# Altium project MT7688.PrjPcb (part 2 of 2)

## Sheet Part15_I2C_LED.SchDoc
size A4
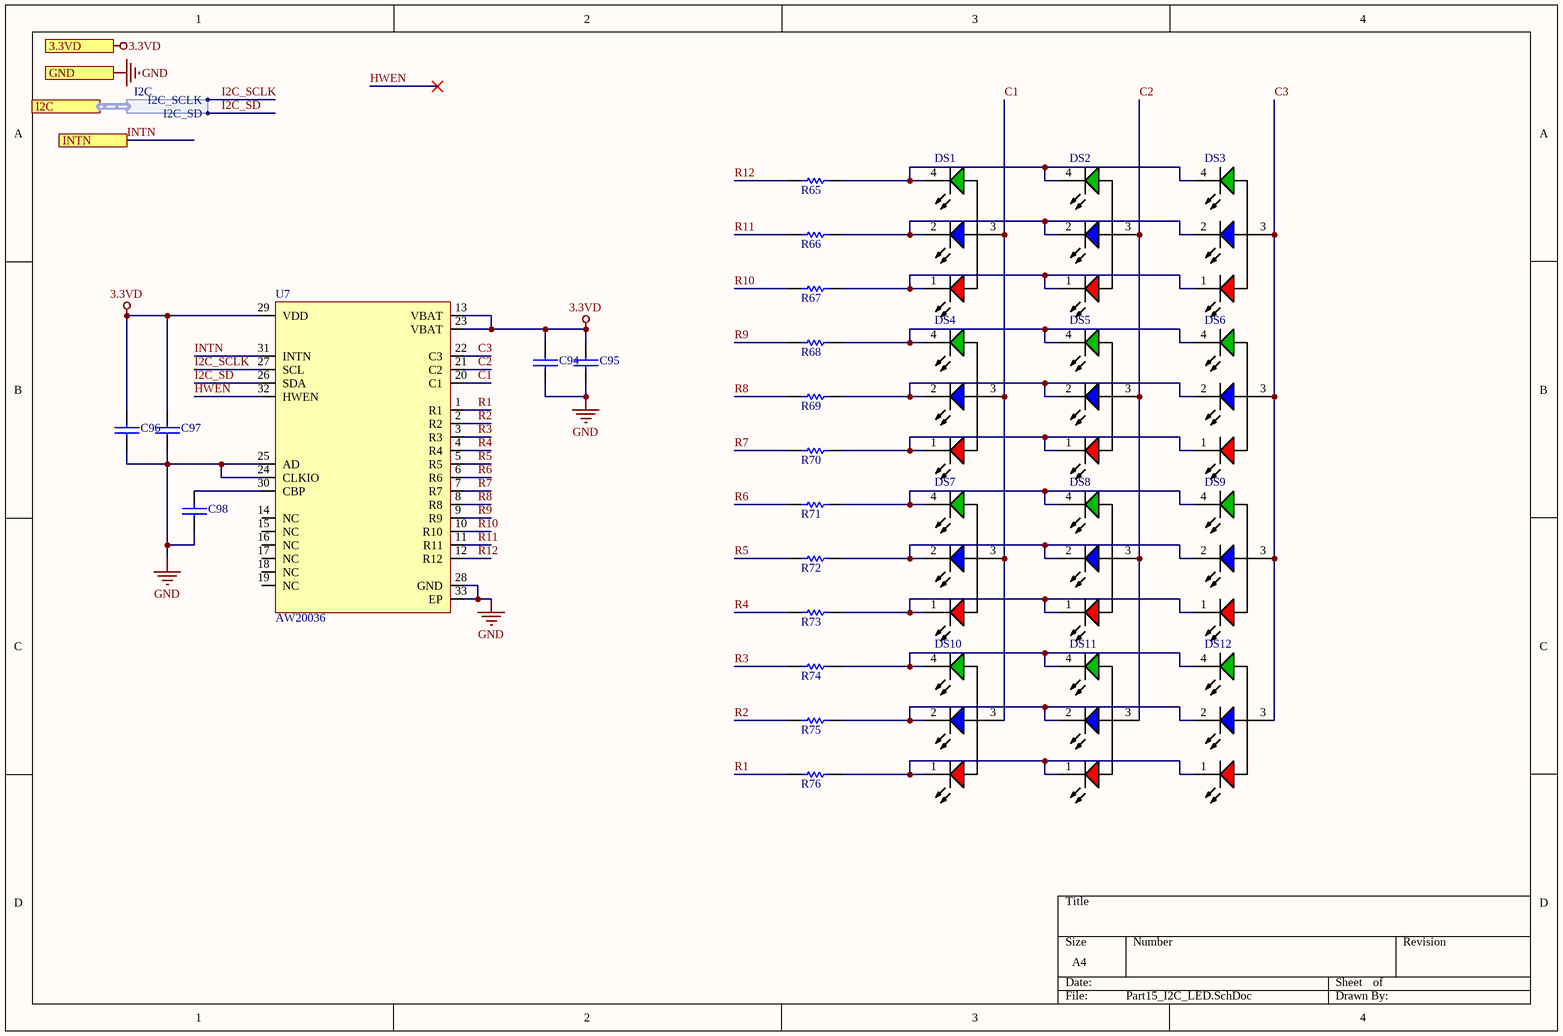
[diagram p21: Part15_I2C_LED.SchDoc]

### Parts
C94  100nF  [0402C]  (value not drawn)
C95  4.7uF  [0402C]  (value not drawn)
C96  1uF  [0402C]  (value not drawn)
C97  100nF  [0402C]  (value not drawn)
C98  1uF  [0402C]  (value not drawn)
DS1  CLVBA-FKA-CAEDH8BBB7A363  [RGB_LED]  (value not drawn)
DS2  CLVBA-FKA-CAEDH8BBB7A363  [RGB_LED]  (value not drawn)
DS3  CLVBA-FKA-CAEDH8BBB7A363  [RGB_LED]  (value not drawn)
DS4  CLVBA-FKA-CAEDH8BBB7A363  [RGB_LED]  (value not drawn)
DS5  CLVBA-FKA-CAEDH8BBB7A363  [RGB_LED]  (value not drawn)
DS6  CLVBA-FKA-CAEDH8BBB7A363  [RGB_LED]  (value not drawn)
DS7  CLVBA-FKA-CAEDH8BBB7A363  [RGB_LED]  (value not drawn)
DS8  CLVBA-FKA-CAEDH8BBB7A363  [RGB_LED]  (value not drawn)
DS9  CLVBA-FKA-CAEDH8BBB7A363  [RGB_LED]  (value not drawn)
DS10  CLVBA-FKA-CAEDH8BBB7A363  [RGB_LED]  (value not drawn)
DS11  CLVBA-FKA-CAEDH8BBB7A363  [RGB_LED]  (value not drawn)
DS12  CLVBA-FKA-CAEDH8BBB7A363  [RGB_LED]  (value not drawn)
R65  51R  [0402R]  (value not drawn)
R66  20R  [0402R]  (value not drawn)
R67  20R  [0402R]  (value not drawn)
R68  51R  [0402R]  (value not drawn)
R69  20R  [0402R]  (value not drawn)
R70  20R  [0402R]  (value not drawn)
R71  51R  [0402R]  (value not drawn)
R72  20R  [0402R]  (value not drawn)
R73  20R  [0402R]  (value not drawn)
R74  51R  [0402R]  (value not drawn)
R75  20R  [0402R]  (value not drawn)
R76  20R  [0402R]  (value not drawn)
U7  AW20036  [QFN40P400X400X80_HS-33N]

### Ports
3.3VD, GND, I2C (harness I2C), INTN

### Harnesses
I2C: I2C_SCLK, I2C_SD

### Nets
3.3VD: C94.1 C95.1 C96.1 C97.1 U7.13(VBAT) U7.23(VBAT) U7.29(VDD) ; port 3.3VD
GND: C94.2 C95.2 C96.2 C97.2 C98.2 U7.24(CLKIO) U7.25(AD) U7.28(GND) U7.33(EP) ; port GND
C1: DS1.3(COMMON) DS4.3(COMMON) DS7.3(COMMON) DS10.3(COMMON) U7.20(C1)
C2: DS2.3(COMMON) DS5.3(COMMON) DS8.3(COMMON) DS11.3(COMMON) U7.21(C2)
C3: DS3.3(COMMON) DS6.3(COMMON) DS9.3(COMMON) DS12.3(COMMON) U7.22(C3)
HWEN: U7.32(HWEN)
I2C_SCLK: U7.27(SCL) ; port I2C.I2C_SCLK
I2C_SD: U7.26(SDA) ; port I2C.I2C_SD
INTN: U7.31(INTN) ; port INTN  [project net EXT_IO_0]
R1: R76.1 U7.1(R1)
R2: R75.1 U7.2(R2)
R3: R74.1 U7.3(R3)
R4: R73.1 U7.4(R4)
R5: R72.1 U7.5(R5)
R6: R71.1 U7.6(R6)
R7: R70.1 U7.7(R7)
R8: R69.1 U7.8(R8)
R9: R68.1 U7.9(R9)
R10: R67.1 U7.10(R10)
R11: R66.1 U7.11(R11)
R12: R65.1 U7.12(R12)
NetC98_1: C98.1 U7.30(CBP)
NetDS1_1: DS1.1(RED) DS2.1(RED) DS3.1(RED) R67.2
NetDS1_2: DS1.2(BLUE) DS2.2(BLUE) DS3.2(BLUE) R66.2
NetDS1_4: DS1.4(GREEN) DS2.4(GREEN) DS3.4(GREEN) R65.2
NetDS4_1: DS4.1(RED) DS5.1(RED) DS6.1(RED) R70.2
NetDS4_2: DS4.2(BLUE) DS5.2(BLUE) DS6.2(BLUE) R69.2
NetDS4_4: DS4.4(GREEN) DS5.4(GREEN) DS6.4(GREEN) R68.2
NetDS7_1: DS7.1(RED) DS8.1(RED) DS9.1(RED) R73.2
NetDS7_2: DS7.2(BLUE) DS8.2(BLUE) DS9.2(BLUE) R72.2
NetDS7_4: DS7.4(GREEN) DS8.4(GREEN) DS9.4(GREEN) R71.2
NetDS10_1: DS10.1(RED) DS11.1(RED) DS12.1(RED) R76.2
NetDS10_2: DS10.2(BLUE) DS11.2(BLUE) DS12.2(BLUE) R75.2
NetDS10_4: DS10.4(GREEN) DS11.4(GREEN) DS12.4(GREEN) R74.2

Not connected (* = marked no-connect by the designer): U7 14(NC) 15(NC) 16(NC) 17(NC) 18(NC) 19(NC)

### Library data of the parts
C94-C98 = CAP: 无极性电容
DS1-DS12 = LED-RGB-KCKK-4: 3-in-1 SMD Led, 1.9 V Red, 3 V Green, 3 V Blue, -40 to 100 degC, 4-Pin PLCC, RoHS, Reel; Luminous Intensity: 71mcd,140mcd,36mcd; Viewing Angle: 120deg; Brand: Cree,Inc.; Lens Color/Style: UVTinted; Forward Current: 20mA; LED Size: 3.2mmx2.8mmx1.9mm; Wavelength/Color Temperature: 630nm,527nm,470nm; Forward Voltage: 1.9V,3V,3V; Illumination Color: RGB; Package / Case: PLCC-4; Package Reference: PLCC-4; Packaging: Reel; Maximum Operating Temperature: +100C; Minimum Operating Temperature: -40C; Product Category: StandardLEDs-SMD; Manufacturer URL: http://www.cree.com/; RoHS: Details; Factory Pack Quantity: 2000; Datasheet URL: http://datasheet.octopart.com/CLVBA-FKA-CAEDH8BBB7A363-Cree-datasheet-44497822.pdf; Manufacturer: Cree,Inc.; Mounting Technology: SurfaceMount; Package Description: 4-Pin Plastic Leaded Chip Carrier, Body 3.2 x 2.8 mm; Datasheet Version: 12/2014
R65-R76 = RES

## Sheet Part16_I2C_MPU9250.SchDoc
size A4
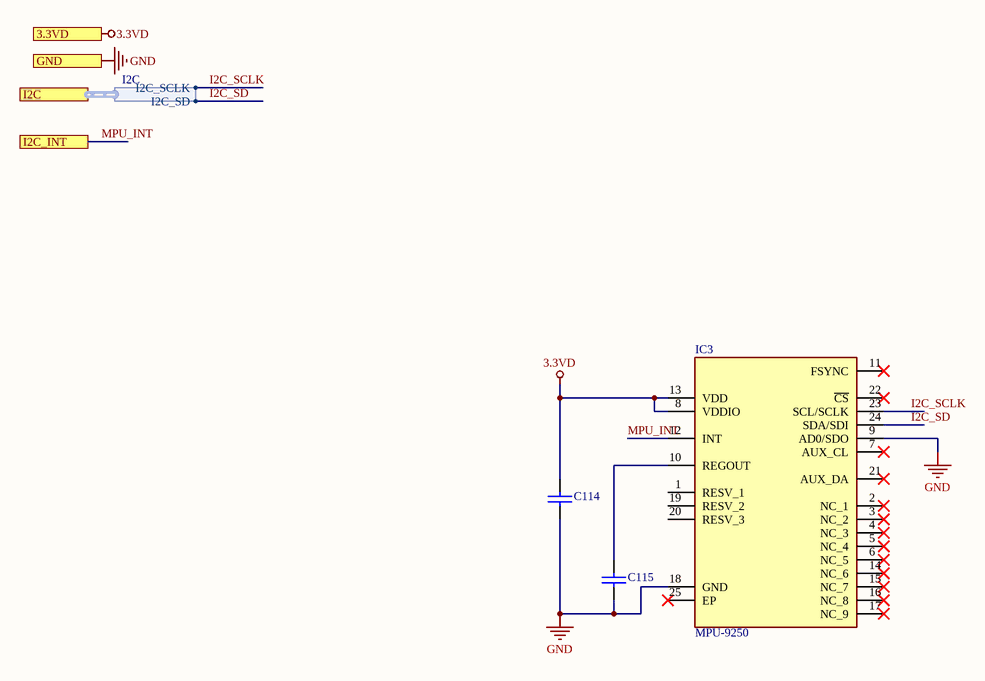
[diagram p22: Part16_I2C_MPU9250.SchDoc]

### Parts
C114  100nF  [0402C]  (value not drawn)
C115  100nF  [0402C]  (value not drawn)
IC3  MPU-9250  [QFN40P300X300X105-25N-D]

### Ports
3.3VD, GND, I2C (harness I2C), I2C_INT

### Harnesses
I2C: I2C_SCLK, I2C_SD

### Nets
3.3VD: C114.1 IC3.8(VDDIO) IC3.13(VDD) ; port 3.3VD
GND: C114.2 C115.2 IC3.9(AD0/SDO) IC3.18(GND) ; port GND
I2C_SCLK: IC3.23(SCL/SCLK) ; port I2C.I2C_SCLK
I2C_SD: IC3.24(SDA/SDI) ; port I2C.I2C_SD
MPU_INT: IC3.12(INT) ; port I2C_INT  [project net EXT_IO_1]
NetC115_1: C115.1 IC3.10(REGOUT)

Not connected (* = marked no-connect by the designer): IC3 1(RESV_1) 2(NC_1)* 3(NC_2)* 4(NC_3)* 5(NC_4)* 6(NC_5)* 7(AUX_CL)* 11(FSYNC)* 14(NC_6)* 15(NC_7)* 16(NC_8)* 17(NC_9)* 19(RESV_2) 20(RESV_3) 21(AUX_DA)* 22(~{CS})* 25(EP)*

### Library data of the parts
C114 C115 = CAP: 无极性电容
IC3 = MPU-9250: Integrated Circuit; Manufacturer_Name: InvenSense Inc.; Datasheet Link: https://store.invensense.com/datasheets/invensense/MPU9250REV1.0.pdf; Height: 1.05mm; Manufacturer_Part_Number: MPU-9250; Arrow Part Number: MPU-9250; Mouser Part Number: 410-MPU-9250; Mouser Price/Stock: https://www.mouser.co.uk/ProductDetail/TDK-InvenSense/MPU-9250?qs=u4fy%2FsgLU9OhGjFkQSZssA%3D%3D

## Sheet Part17_I2C_SHT30.SchDoc
size A4
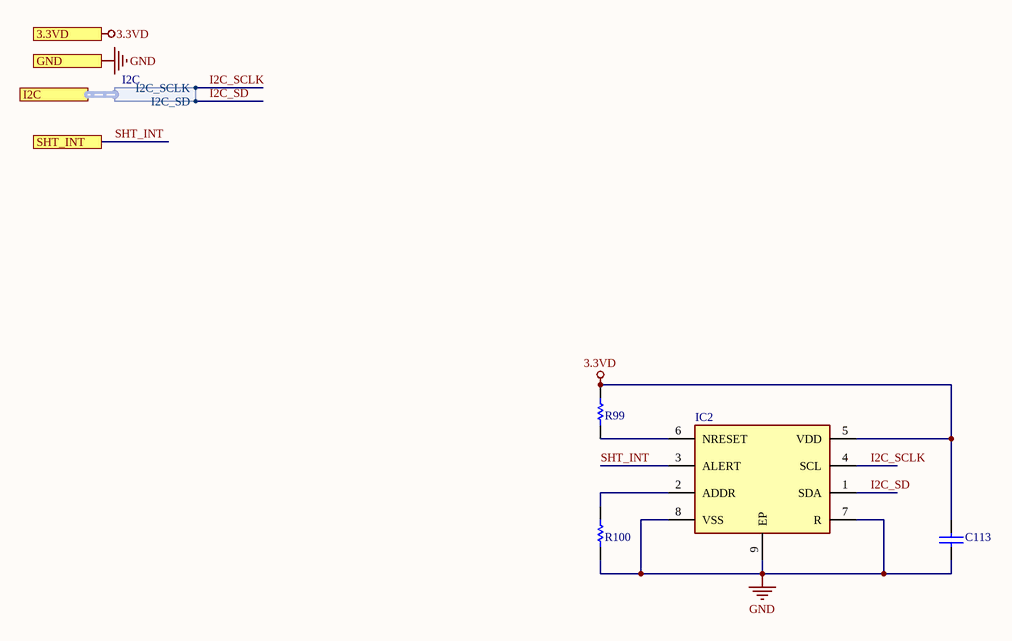
[diagram p23: Part17_I2C_SHT30.SchDoc]

### Parts
C113  100nF  [0402C]  (value not drawn)
IC2  SHT31-DIS-B2.5KS  [SON50P250X250X100-9N-D]  (value not drawn)
R99  10K  [0402R]  (value not drawn)
R100  10K  [0402R]  (value not drawn)

### Ports
3.3VD, GND, I2C (harness I2C), SHT_INT

### Harnesses
I2C: I2C_SCLK, I2C_SD

### Nets
3.3VD: C113.1 IC2.5(VDD) R99.2 ; port 3.3VD
GND: C113.2 IC2.7(R) IC2.8(VSS) IC2.9(EP) R100.1 ; port GND
I2C_SCLK: IC2.4(SCL) ; port I2C.I2C_SCLK
I2C_SD: IC2.1(SDA) ; port I2C.I2C_SD
SHT_INT: IC2.3(ALERT) ; port SHT_INT  [project net EXT_IO_2]
NetIC2_2: IC2.2(ADDR) R100.2
NetIC2_6: IC2.6(NRESET) R99.1

### Library data of the parts
C113 = CAP: 无极性电容
IC2 = SHT31-DIS-B2.5KS: Integrated Circuit; Manufacturer_Name: Sensirion; Datasheet Link: http://www.mouser.com/ds/2/682/Sensirion_Humidity_Sensors_SHT3x_Datasheet_digital-971521.pdf; Height: 1mm; Manufacturer_Part_Number: SHT31-DIS-B2.5KS; Arrow Part Number: SHT31-DIS-B2.5KS; Arrow Price/Stock: https://www.arrow.com/en/products/sht31-dis-b2.5ks/sensirion-ag; Mouser Part Number: 403-SHT31-DIS-B; Mouser Price/Stock: https://www.mouser.co.uk/ProductDetail/Sensirion/SHT31-DIS-B25kS?qs=y6ZabgHbY%252ByCkzTLGvP3Qw%3D%3D
R99 R100 = RES

## Sheet Part19_UART_CP2104.SchDoc
size A4
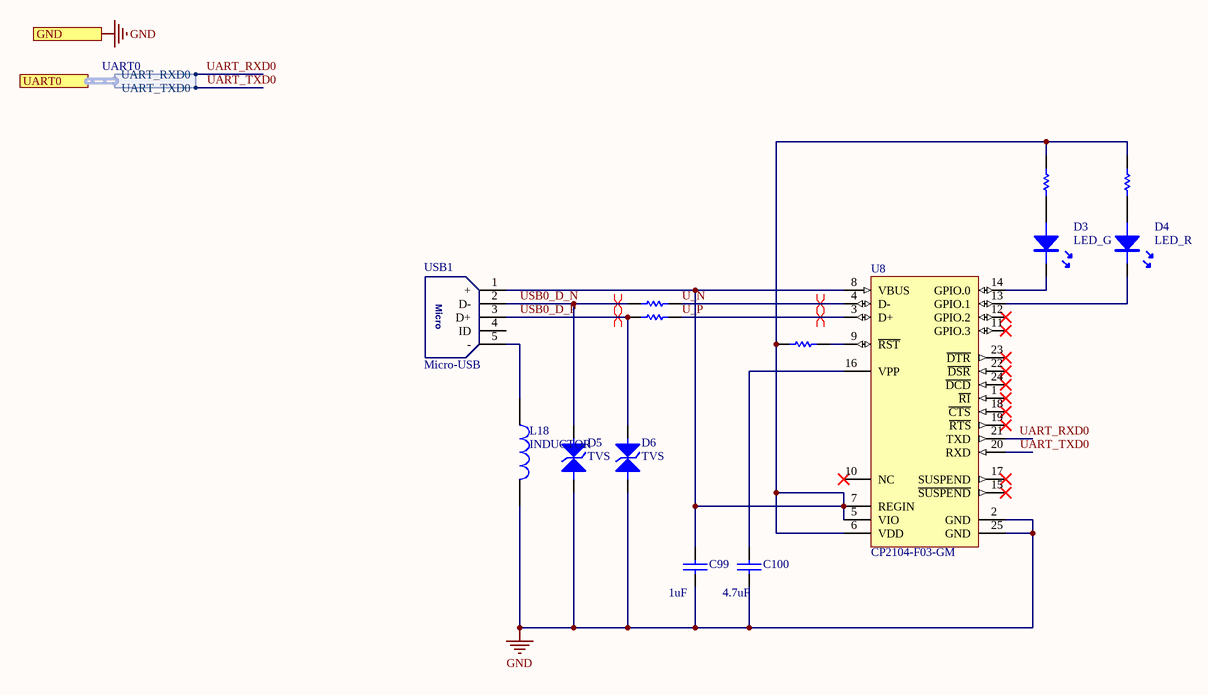
[diagram p24: Part19_UART_CP2104.SchDoc]

### Parts
C99  1uF  [0603C]
C100  4.7uF  [0603C]
D3  LED_G  [LED-0603B]
D4  LED_R  [LED-0603B]
D5  TVS  [SOD-123]
D6  TVS  [SOD-123]
L18  INDUCTOR  [0603L]
R77  470R  [0402R]  (value not drawn)
R78  470R  [0402R]  (value not drawn)
R79  22R  [0402R]  (value not drawn)
R80  22R  [0402R]  (value not drawn)
R81  4.7k  [0402R]  (value not drawn)
U8  CP2104-F03-GM  [SLAB-QFN-24-2675x2675TP_M]
USB1  Micro-USB  [USB-micro_B]

### Ports
GND, UART0 (harness UART0)

### Harnesses
UART0: UART_RXD0, UART_TXD0

### Nets
GND: C99.1 C100.1 D5.K D6.K L18.2 U8.2(GND) U8.25(GND) ; port GND
U_N: R79.2 U8.4(D-)
U_P: R80.2 U8.3(D+)
UART_RXD0: U8.21(TXD) ; port UART0.UART_RXD0
UART_TXD0: U8.20(RXD) ; port UART0.UART_TXD0
USB0_D_N: D5.A R79.1 USB1.2(D-)
USB0_D_P: D6.A R80.1 USB1.3(D+)
NetC99_2: C99.2 R77.2 R78.2 R81.1 U8.5(VIO) U8.6(VDD) U8.7(REGIN) U8.8(VBUS) USB1.1(+)
NetC100_2: C100.2 U8.16(VPP)
NetD3_A: D3.A R77.1
NetD3_K: D3.K U8.14(GPIO.0)
NetD4_A: D4.A R78.1
NetD4_K: D4.K U8.13(GPIO.1)
NetL18_1: L18.1 USB1.5(-)
NetR81_2: R81.2 U8.9(~{RST})

Not connected (* = marked no-connect by the designer): U8 1(~{RI})* 10(NC)* 11(GPIO.3)* 12(GPIO.2)* 15(~{SUSPEND})* 17(SUSPEND)* 18(~{CTS})* 19(~{RTS})* 22(~{DSR})* 23(~{DTR})* 24(~{DCD})*; USB1 4(ID)

### Layout directives
differential pair: U_N, U_P, USB0_D_N, USB0_D_P

### Notes on the sheet
- (in symbol Micro-USB) Micro

### Library data of the parts
C99 C100 = CAP: 无极性电容
D3 D4 = LED
D5 D6 = TVS: 双向瞬态抑制二极管
R77-R81 = RES
U8 = CMP-0511-00004-1: Single-Chip USB to UART Bridge, 4 Dig I/O Pins, Internal Oscillator, 1024 Bytes EEPROM, -40 to 85 degC, 24-pin QFN; Manufacturer: Silicon Labs; Sub-Family: USB Bridges; Internal Oscillator: TRUE; Mounting Technology: Surface Mount; ComponentLink3URL: http://www.silabs.com/Support%20Documents/TechnicalDocs/C8051F93x-92x.pdf; DatasheetVersion: Rev. 1.0; ComponentLink1URL: http://www.silabs.com/; Code_IPC: J-STD-020; ComponentLink2URL: http://www.silabs.com/Support%20Documents/TechnicalDocs/cp2104.pdf; Code_JEDEC: MO-220; PackageReference: QFN-24; ComponentLink3Description: Package Specification; PartNumber: CP2104-F03-GM; ComponentLink1Description: Manufacturer URL; ComponentLink2Description: Datasheet; EEPROM: 1024 Bytes; PackageDescription: 24-Pin Quad-Flat No-Leads Package, Body 4 x 4 mm, Pitch 0.5 mm

## Nets that join several sheets
3.3VD: Part03_MT7688_Peripheral (14 pins), Part04_MT7688_Power (9 pins), Part01_MT7688_RF (C1.2 C2.2 C3.2 R1.1), Part09_Config (7 pins), Part13_Power (R48.2), Part22_ETH_WAN (C103.1 R83.1), Part07_NorFlash (5 pins), Part25_Button_LED (6 pins), Part23_ETH_LAN (C107.1 R89.1), Part10_SD_card (9 pins), Part18_I2C_IO_Expander (C138.2 U12.16), Part15_I2C_LED (7 pins), Part16_I2C_MPU9250 (C114.1 IC3.8 IC3.13), Part17_I2C_SHT30 (C113.1 IC2.5 R99.2)
5V: Part13_Power (C90.2 C91.2 R53.2), Part11_I2S_WM8960 (L21.1), Part12_USB_HUB (F1.1 R40.2 R44.2 R46.1)
DDR_1V8: Part04_MT7688_Power (TC6.1 TC7.1 U1.125), Part02_MT7688_DDR (15 pins), Part05_DDR2 (24 pins)
DDR_VREF: Part02_MT7688_DDR (C29.1 C30.1 U1.90 U1.104), Part05_DDR2 (5 pins)
GND: Part03_MT7688_Peripheral (15 pins), Part04_MT7688_Power (17 pins), Part01_MT7688_RF (36 pins), Part09_Config (7 pins), Part02_MT7688_DDR (16 pins), Part13_Power (23 pins), Part05_DDR2 (24 pins), Part22_ETH_WAN (8 pins), Part07_NorFlash (C64.2 U3.4), Part25_Button_LED (D8.K K1.3 TC15.2), Part23_ETH_LAN (8 pins), Part11_I2S_WM8960 (C118.2 C123.2 L23.1 U4.9), Part14_SPI_ST7789 (8 pins), Part20_UART_BLE (6 pins), Part10_SD_card (C92.2 C93.2 SD1.0 SD1.6), Part12_USB_HUB (31 pins), Part18_I2C_IO_Expander (5 pins), Part15_I2C_LED (9 pins), Part16_I2C_MPU9250 (C114.2 C115.2 IC3.9 IC3.18), Part17_I2C_SHT30 (5 pins), Part19_UART_CP2104 (7 pins)
SOC_1.2VD_MT7688: Part03_MT7688_Peripheral (C48.1 U1.131), Part04_MT7688_Power (15 pins)
CLK: Part03_MT7688_Peripheral (R3.2), Part09_Config (R27.2 R28.2), Part07_NorFlash (U3.6), Part14_SPI_ST7789 (U10.9)
CLK_N: Part02_MT7688_DDR (U1.76), Part05_DDR2 (R13.2 U2.K8)
CLK_P: Part02_MT7688_DDR (U1.77), Part05_DDR2 (R13.1 U2.J8)
CPURST_N: Part03_MT7688_Peripheral (U1.138), Part25_Button_LED (K1.1 R111.2)
CS0: Part03_MT7688_Peripheral (U1.28), Part07_NorFlash (R18.2 U3.1)
DDR_CASN: Part02_MT7688_DDR (U1.75), Part05_DDR2 (U2.L7)
DDR_CSN: Part02_MT7688_DDR (U1.78), Part05_DDR2 (U2.L8)
DDR_MBA0: Part02_MT7688_DDR (U1.100), Part05_DDR2 (U2.L2)
DDR_MBA1: Part02_MT7688_DDR (U1.99), Part05_DDR2 (U2.L3)
DDR_MBA2: Part02_MT7688_DDR (U1.101), Part05_DDR2 (U2.L1)
DDR_MCKE: Part02_MT7688_DDR (U1.103), Part05_DDR2 (U2.K2)
DDR_MDQM0: Part02_MT7688_DDR (U1.108), Part05_DDR2 (U2.F3)
DDR_MDQM1: Part02_MT7688_DDR (U1.64), Part05_DDR2 (U2.B3)
DDR_MDQS0: Part02_MT7688_DDR (U1.113), Part05_DDR2 (U2.F7)
DDR_MDQS1: Part02_MT7688_DDR (U1.72), Part05_DDR2 (U2.B7)
DDR_MODT: Part02_MT7688_DDR (U1.74), Part05_DDR2 (R14.2 R15.1 U2.K9)
DDR_RASN: Part02_MT7688_DDR (U1.81), Part05_DDR2 (U2.K7)
DDR_WEN: Part02_MT7688_DDR (U1.102), Part05_DDR2 (U2.K3)
EPH_LED0_N: Part03_MT7688_Peripheral (U1.143), Part22_ETH_WAN (R84.2)
EPH_LED1_N: Part03_MT7688_Peripheral (U1.142), Part23_ETH_LAN (R90.2)
EXT__4: Part06_DIP (J5.3), Part18_I2C_IO_Expander (U12.9)
EXT__5: Part06_DIP (J5.4), Part18_I2C_IO_Expander (U12.10)
EXT__6: Part06_DIP (J5.5), Part18_I2C_IO_Expander (U12.12)
EXT__7: Part06_DIP (J5.6), Part18_I2C_IO_Expander (U12.11)
EXT_BTN_IN: Part25_Button_LED (K2.1), Part18_I2C_IO_Expander (U12.7)
EXT_INT: Part03_MT7688_Peripheral (U1.29), Part25_Button_LED (D2.K), Part14_SPI_ST7789 (U10.7), Part18_I2C_IO_Expander (U12.13)
EXT_IO_0: Part18_I2C_IO_Expander (U12.4), Part15_I2C_LED (U7.31)
EXT_IO_1: Part18_I2C_IO_Expander (U12.5), Part16_I2C_MPU9250 (IC3.12)
EXT_IO_2: Part18_I2C_IO_Expander (U12.6), Part17_I2C_SHT30 (IC2.3)
I2C_SCLK: Part03_MT7688_Peripheral (R5.1 U1.20), Part11_I2S_WM8960 (U4.17), Part18_I2C_IO_Expander (U12.14), Part15_I2C_LED (U7.27), Part16_I2C_MPU9250 (IC3.23), Part17_I2C_SHT30 (IC2.4)
I2C_SD: Part03_MT7688_Peripheral (R4.1 U1.21), Part11_I2S_WM8960 (U4.18), Part18_I2C_IO_Expander (U12.15), Part15_I2C_LED (U7.26), Part16_I2C_MPU9250 (IC3.24), Part17_I2C_SHT30 (IC2.1)
I2S_CLK: Part03_MT7688_Peripheral (U1.19), Part11_I2S_WM8960 (R22.1)
I2S_DI: Part03_MT7688_Peripheral (U1.16), Part11_I2S_WM8960 (R101.1)
I2S_DO: Part03_MT7688_Peripheral (U1.17), Part09_Config (R37.2 R38.2), Part11_I2S_WM8960 (R23.1)
I2S_WS: Part03_MT7688_Peripheral (U1.18), Part11_I2S_WM8960 (R24.1)
MADDR0: Part02_MT7688_DDR (U1.80), Part05_DDR2 (U2.M8)
MADDR1: Part02_MT7688_DDR (U1.88), Part05_DDR2 (U2.M3)
MADDR2: Part02_MT7688_DDR (U1.87), Part05_DDR2 (U2.M7)
MADDR3: Part02_MT7688_DDR (U1.97), Part05_DDR2 (U2.N2)
MADDR4: Part02_MT7688_DDR (U1.82), Part05_DDR2 (U2.N8)
MADDR5: Part02_MT7688_DDR (U1.93), Part05_DDR2 (U2.N3)
MADDR6: Part02_MT7688_DDR (U1.86), Part05_DDR2 (U2.N7)
MADDR7: Part02_MT7688_DDR (U1.95), Part05_DDR2 (U2.P2)
MADDR8: Part02_MT7688_DDR (U1.84), Part05_DDR2 (U2.P8)
MADDR9: Part02_MT7688_DDR (U1.94), Part05_DDR2 (U2.P3)
MADDR10: Part02_MT7688_DDR (U1.92), Part05_DDR2 (U2.M2)
MADDR11: Part02_MT7688_DDR (U1.85), Part05_DDR2 (U2.P7)
MADDR12: Part02_MT7688_DDR (U1.96), Part05_DDR2 (U2.R2)
MADDR13: Part02_MT7688_DDR (U1.83), Part05_DDR2 (U2.R8)
MDATA0: Part02_MT7688_DDR (U1.71), Part05_DDR2 (U2.G8)
MDATA1: Part02_MT7688_DDR (U1.107), Part05_DDR2 (U2.G2)
MDATA2: Part02_MT7688_DDR (U1.69), Part05_DDR2 (U2.H7)
MDATA3: Part02_MT7688_DDR (U1.105), Part05_DDR2 (U2.H3)
MDATA4: Part02_MT7688_DDR (U1.106), Part05_DDR2 (U2.H1)
MDATA5: Part02_MT7688_DDR (U1.73), Part05_DDR2 (U2.H9)
MDATA6: Part02_MT7688_DDR (U1.109), Part05_DDR2 (U2.F1)
MDATA7: Part02_MT7688_DDR (U1.70), Part05_DDR2 (U2.F9)
MDATA8: Part02_MT7688_DDR (U1.66), Part05_DDR2 (U2.C8)
MDATA9: Part02_MT7688_DDR (U1.112), Part05_DDR2 (U2.C2)
MDATA10: Part02_MT7688_DDR (U1.68), Part05_DDR2 (U2.D7)
MDATA11: Part02_MT7688_DDR (U1.110), Part05_DDR2 (U2.D3)
MDATA12: Part02_MT7688_DDR (U1.111), Part05_DDR2 (U2.D1)
MDATA13: Part02_MT7688_DDR (U1.67), Part05_DDR2 (U2.D9)
MDATA14: Part02_MT7688_DDR (U1.114), Part05_DDR2 (U2.B1)
MDATA15: Part02_MT7688_DDR (U1.65), Part05_DDR2 (U2.B9)
MISO: Part03_MT7688_Peripheral (U1.26), Part07_NorFlash (U3.2)
MOSI: Part03_MT7688_Peripheral (U1.27), Part09_Config (R25.2 R26.2), Part07_NorFlash (U3.5), Part14_SPI_ST7789 (U10.10)
PERST_N: Part03_MT7688_Peripheral (U1.135), Part09_Config (R35.2 R36.2)
PWM_CH0: Part03_MT7688_Peripheral (U1.45), Part06_DIP (J5.1), Part14_SPI_ST7789 (R97.1)
PWM_CH1: Part03_MT7688_Peripheral (U1.46), Part06_DIP (J5.2)
REF_CLK0: Part03_MT7688_Peripheral (U1.136), Part25_Button_LED (D7.K), Part11_I2S_WM8960 (R21.1)
RXI0_N: Part03_MT7688_Peripheral (U1.34), Part22_ETH_WAN (J3.6 R88.2)
RXI0_P: Part03_MT7688_Peripheral (U1.33), Part22_ETH_WAN (J3.3 R87.2)
RXI1_N: Part03_MT7688_Peripheral (U1.44), Part23_ETH_LAN (J4.6 R94.2)
RXI1_P: Part03_MT7688_Peripheral (U1.43), Part23_ETH_LAN (J4.3 R93.2)
SD_CD: Part03_MT7688_Peripheral (R10.2 U1.50), Part10_SD_card (R63.2 SD1.9)
SD_CLK: Part03_MT7688_Peripheral (U1.54), Part10_SD_card (R64.1)
SD_CMD: Part03_MT7688_Peripheral (U1.55), Part10_SD_card (R60.2 SD1.3)
SD_D0: Part03_MT7688_Peripheral (U1.52), Part10_SD_card (R61.2 SD1.7)
SD_D1: Part03_MT7688_Peripheral (U1.51), Part10_SD_card (R62.2 SD1.8)
SD_D2: Part03_MT7688_Peripheral (U1.56), Part10_SD_card (R58.2 SD1.1)
SD_D3: Part03_MT7688_Peripheral (U1.57), Part10_SD_card (R59.2 SD1.2)
SPI_CS1: Part03_MT7688_Peripheral (U1.24), Part09_Config (R29.2 R31.2), Part14_SPI_ST7789 (U10.8)
TXO0_N: Part03_MT7688_Peripheral (U1.36), Part22_ETH_WAN (J3.2 R86.2)
TXO0_P: Part03_MT7688_Peripheral (U1.35), Part22_ETH_WAN (J3.1 R85.2)
TXO1_N: Part03_MT7688_Peripheral (U1.42), Part23_ETH_LAN (J4.2 R92.2)
TXO1_P: Part03_MT7688_Peripheral (U1.40), Part23_ETH_LAN (J4.1 R91.2)
UART_RXD0: Part03_MT7688_Peripheral (U1.31), Part19_UART_CP2104 (U8.21)
UART_RXD1: Part03_MT7688_Peripheral (U1.148), Part20_UART_BLE (U9.7)
UART_TXD0: Part03_MT7688_Peripheral (U1.30), Part09_Config (R33.2 R34.2), Part19_UART_CP2104 (U8.20)
UART_TXD1: Part03_MT7688_Peripheral (U1.147), Part09_Config (R30.2 R32.2), Part20_UART_BLE (U9.8)
USB_D_N: Part03_MT7688_Peripheral (C43.1 R8.1), Part12_USB_HUB (IC1.25)
USB_D_P: Part03_MT7688_Peripheral (C42.1 R7.1), Part12_USB_HUB (IC1.26)
WLED_N: Part03_MT7688_Peripheral (U1.144), Part25_Button_LED (D1.K)